# Altium project BetterFC.PrjPcb
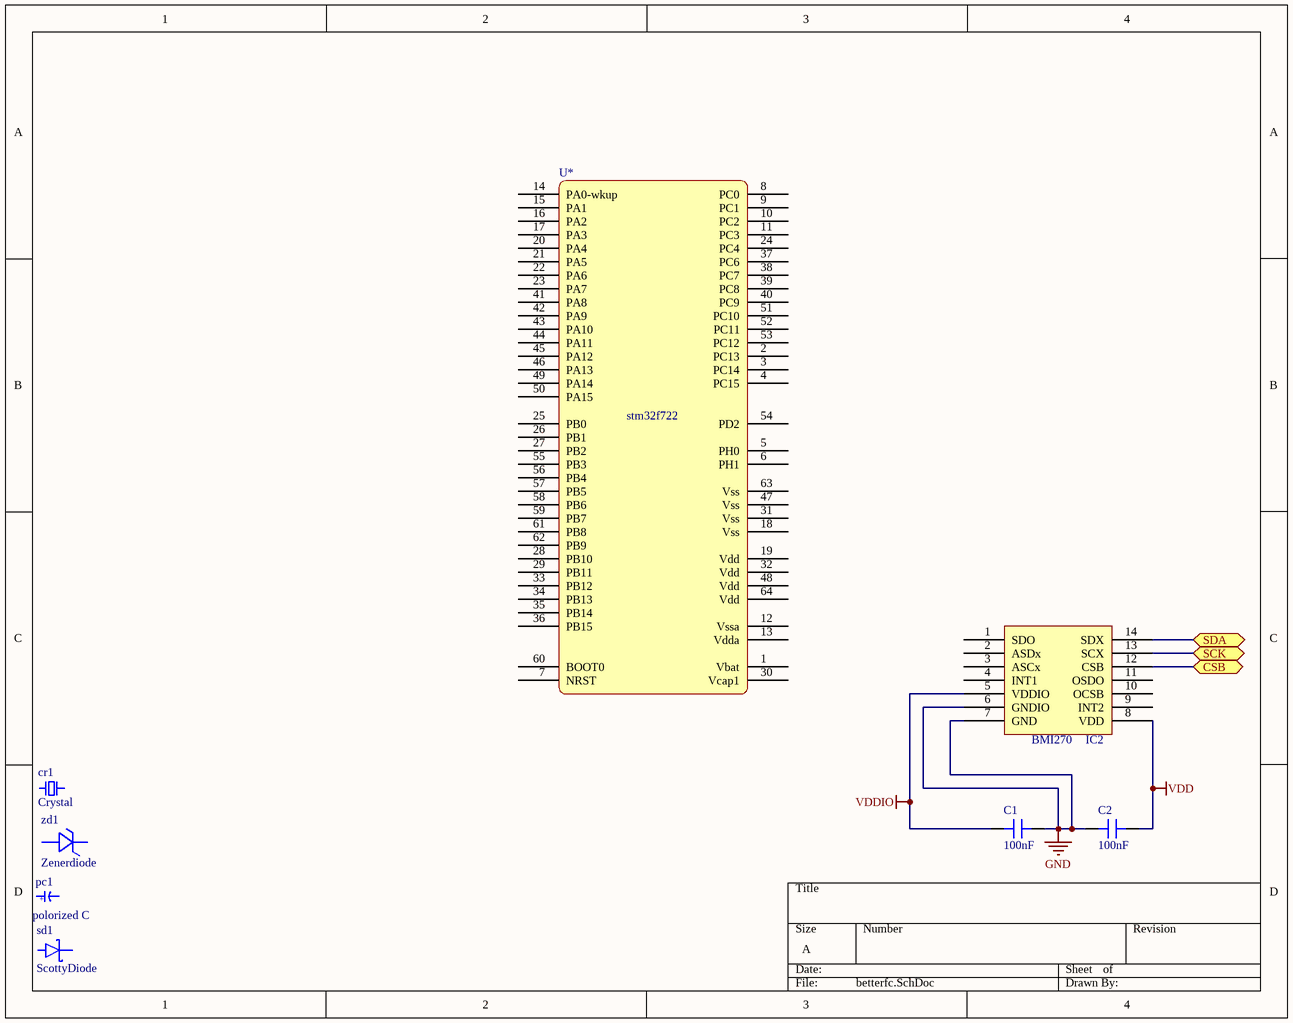
[diagram p0: betterfc.SchDoc]
1 sheet, 8 parts. Net scope: flat (ports and power ports of the same name join across sheets).

## Sheet betterfc.SchDoc
size A; SheetNumber: 1; SheetTotal: 1

### Parts
C1  100nF
C2  100nF
cr1  Crystal
IC2  BMI270
pc1  polorized C
sd1  ScottyDiode
U*  stm32f722
zd1  Zenerdiode

### Ports
CSB (bidir), SCK (bidir), SDA (bidir)

### Nets
GND: C1.1 C2.1 IC2.6(GNDIO) IC2.7(GND)
VDD: C2.2 IC2.8(VDD)
VDDIO: C1.2 IC2.5(VDDIO)
NetIC2_12: IC2.12(CSB) ; port CSB
NetIC2_13: IC2.13(SCX) ; port SCK
NetIC2_14: IC2.14(SDX) ; port SDA

Not connected (* = marked no-connect by the designer): IC2 1(SDO) 2(ASDx) 3(ASCx) 4(INT1) 9(INT2) 10(OCSB) 11(OSDO); U* 1(Vbat) 2(PC13) 3(PC14) 4(PC15) 5(PH0) 6(PH1) 7(NRST) 8(PC0) 9(PC1) 10(PC2) 11(PC3) 12(Vssa) 13(Vdda) 14(PA0-wkup) 15(PA1) 16(PA2) 17(PA3) 18(Vss) 19(Vdd) 20(PA4) 21(PA5) 22(PA6) 23(PA7) 24(PC4) 25(PB0) 26(PB1) 27(PB2) 28(PB10) 29(PB11) 30(Vcap1) 31(Vss) 32(Vdd) 33(PB12) 34(PB13) 35(PB14) 36(PB15) 37(PC6) 38(PC7) 39(PC8) 40(PC9) 41(PA8) 42(PA9) 43(PA10) 44(PA11) 45(PA12) 46(PA13) 47(Vss) 48(Vdd) 49(PA14) 50(PA15) 51(PC10) 52(PC11) 53(PC12) 54(PD2) 55(PB3) 56(PB4) 57(PB5) 58(PB6) 59(PB7) 60(BOOT0) 61(PB8) 62(PB9) 63(Vss) 64(Vdd)

### Notes on the sheet
- (in symbol polorized C) +

### Library data of the parts
C1 C2 = C